# Altium project PCB_Project_2.PrjPcb (part 1 of 3)
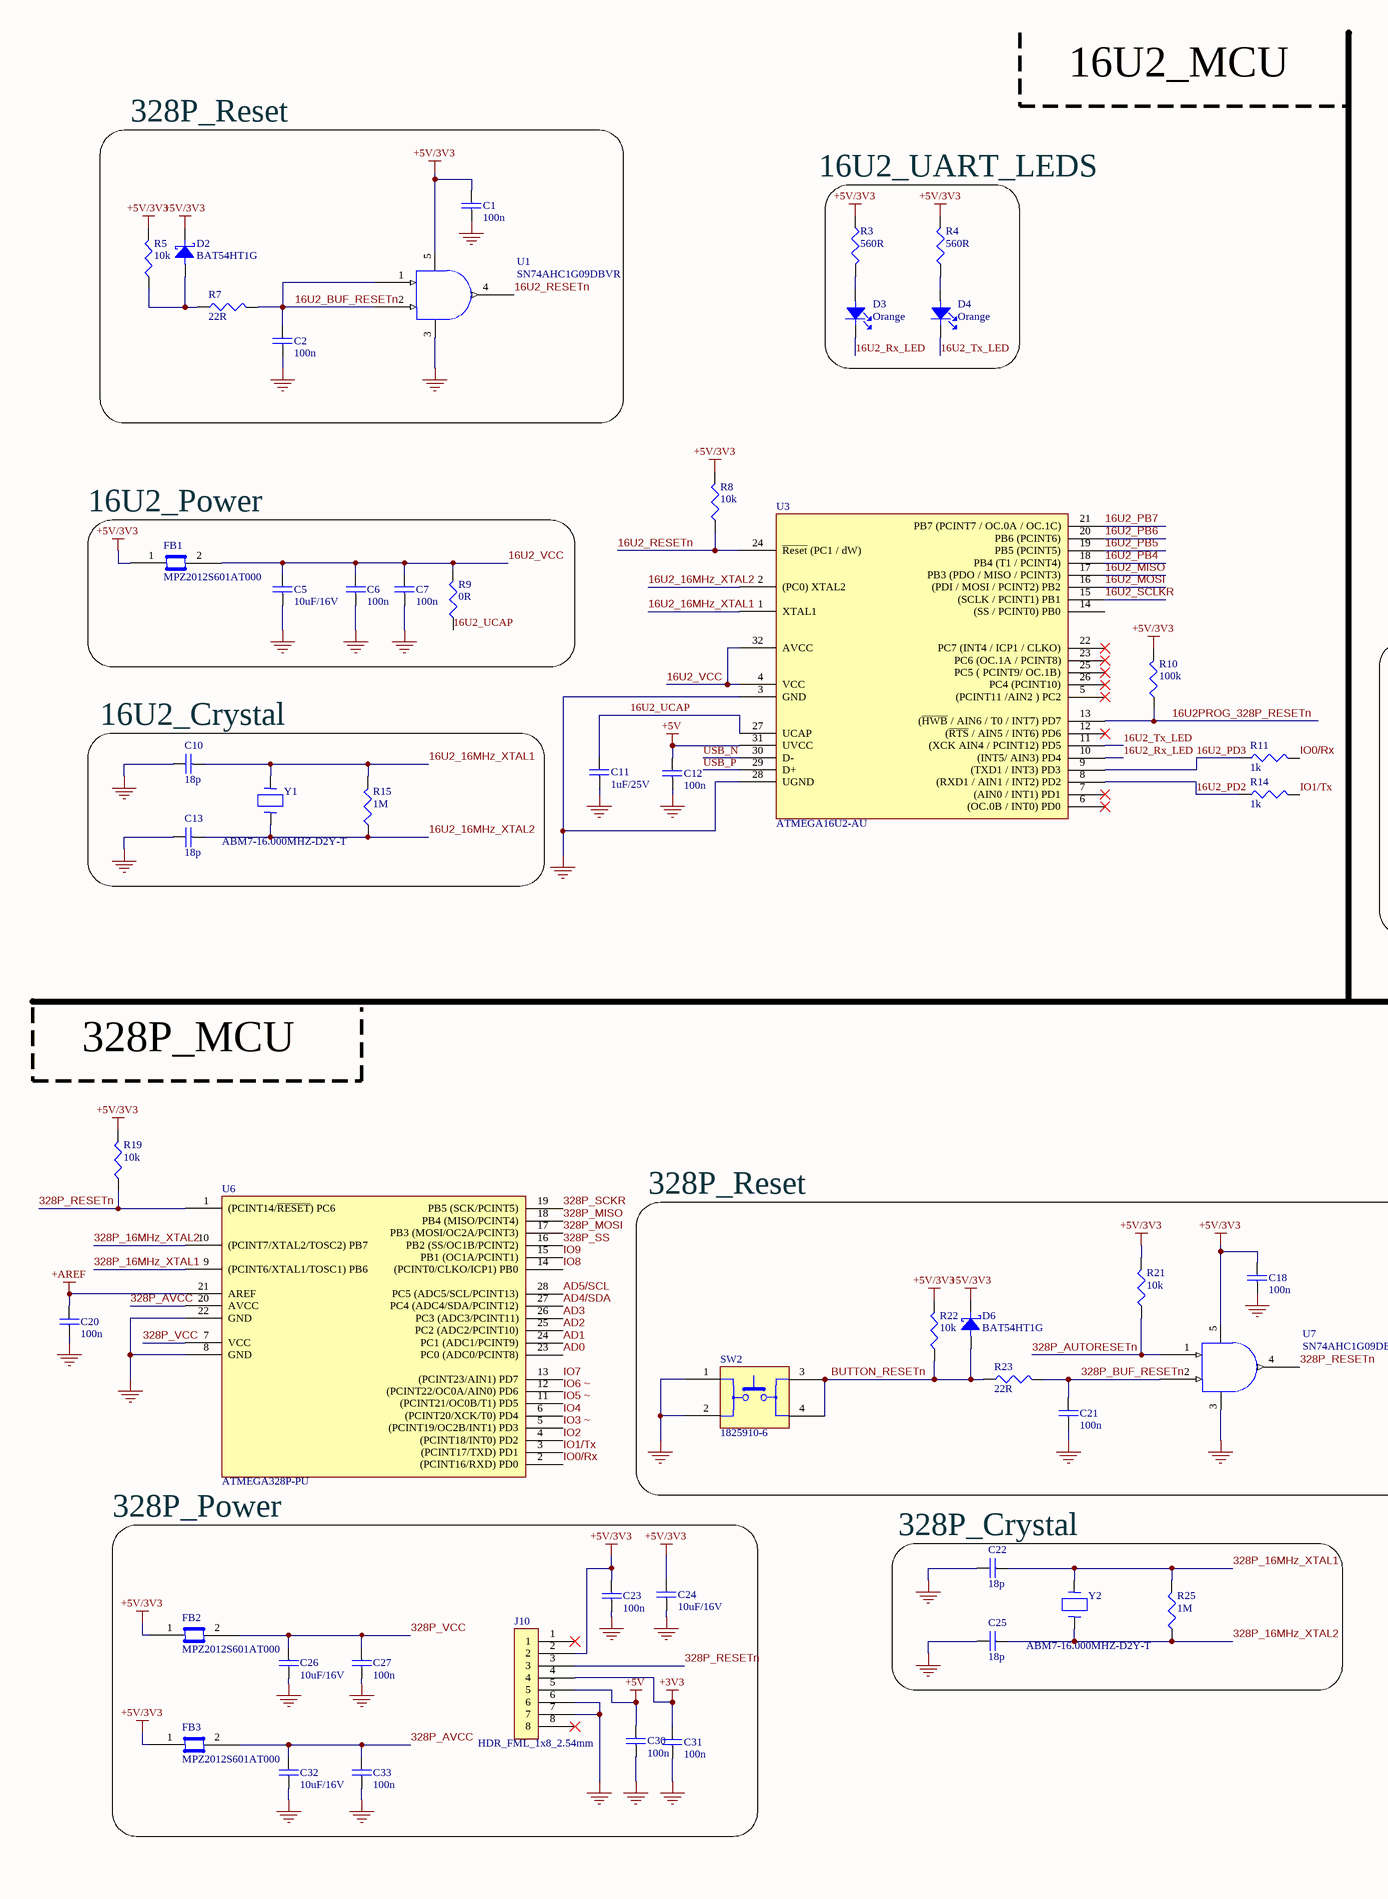
[diagram p0: Sheet1.SchDoc, left]
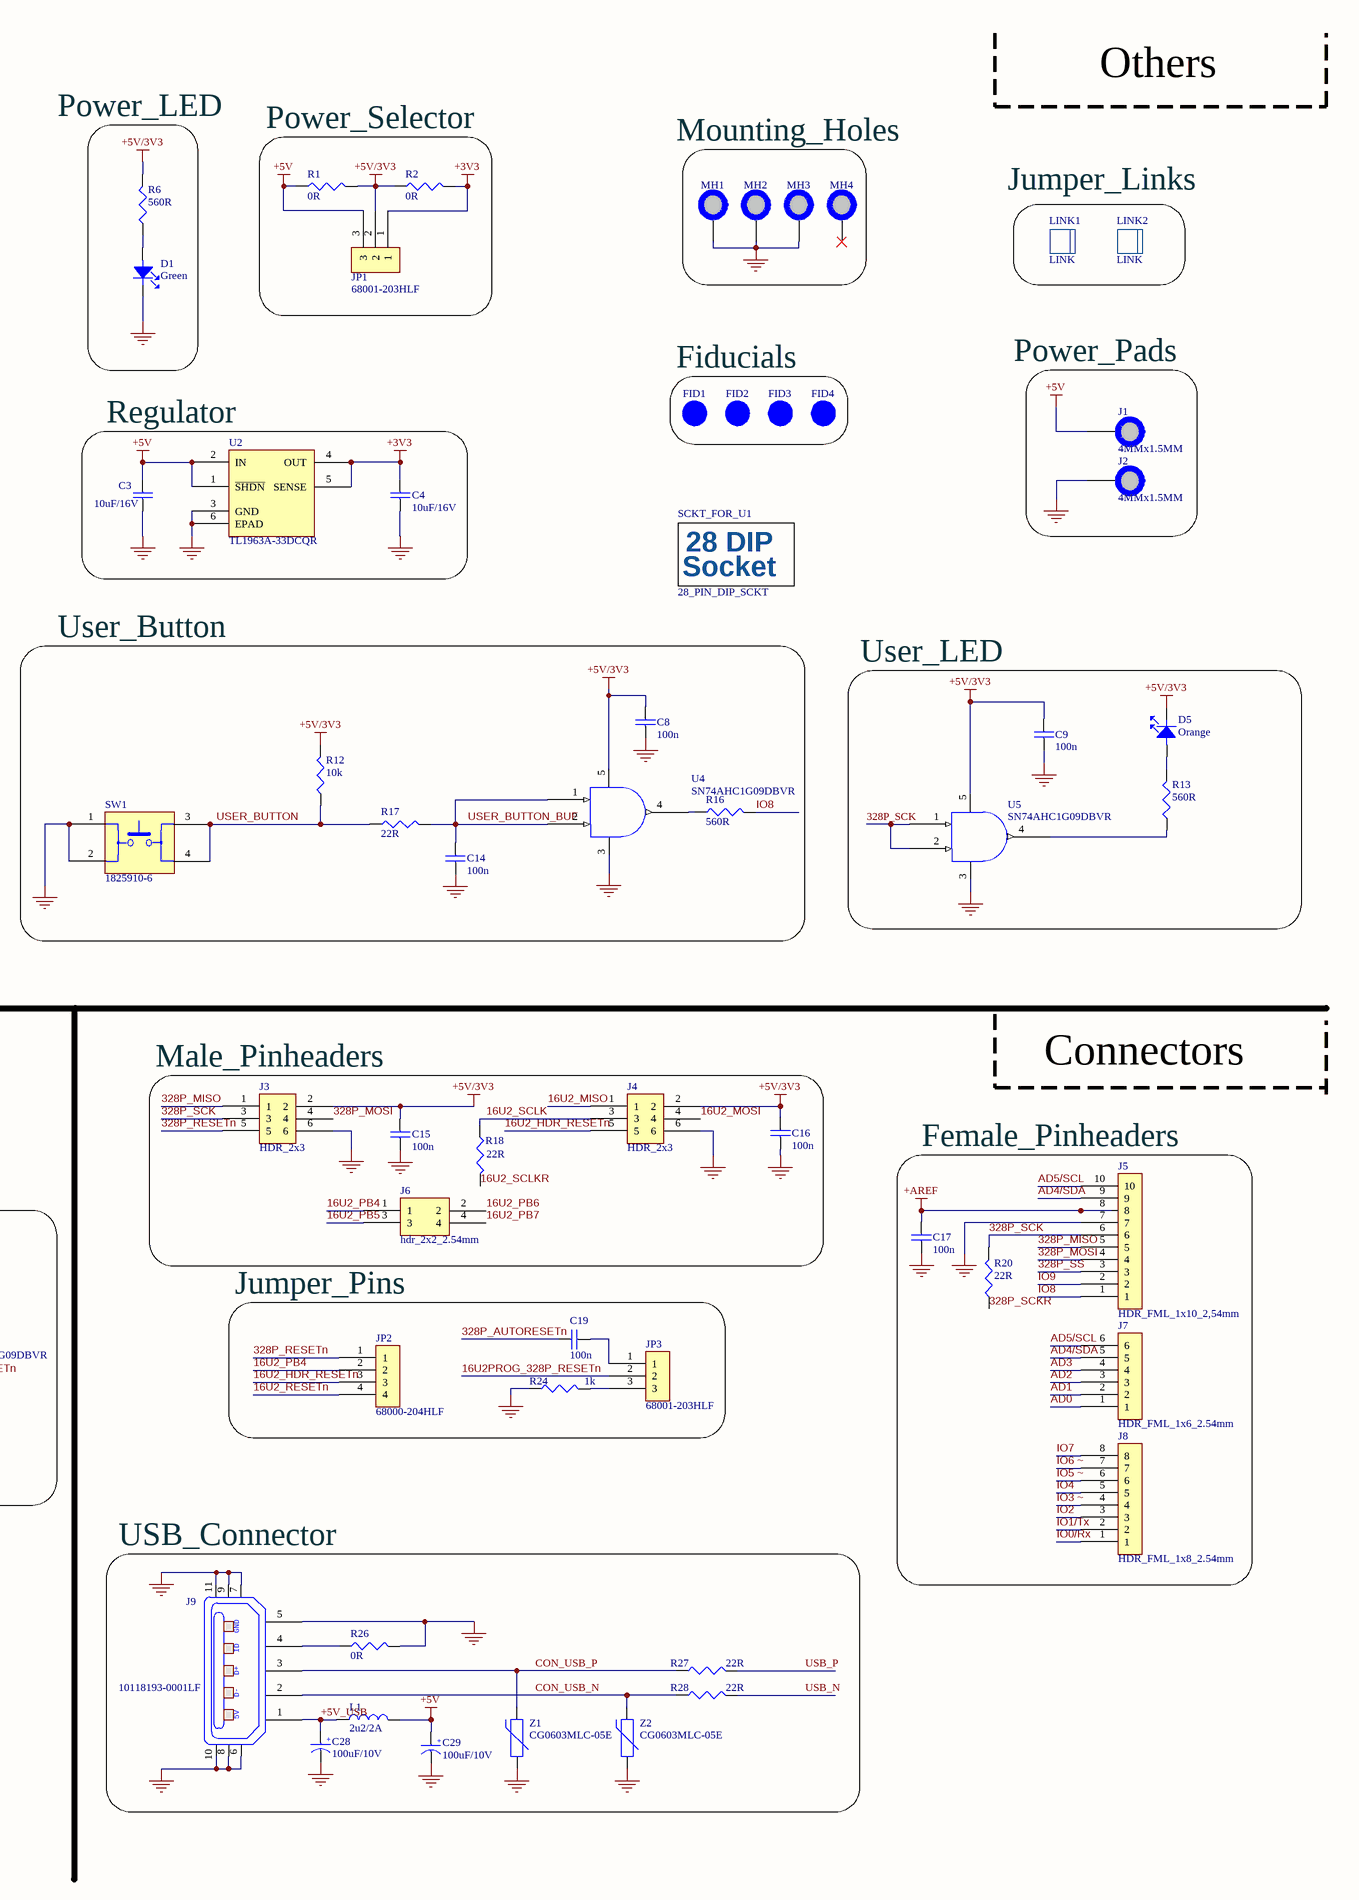
[diagram p1: Sheet1.SchDoc, right]
NotFitted: NF
1 sheet, 108 parts. Net scope: global (net labels, ports and power ports of the same name join across sheets).
Board file: PCB1.PcbDoc

## Sheet Sheet1.SchDoc
size A2; SheetNumber: 1; SheetTotal: 1

### Parts
C1  100n  [C0805_100n]
C2  100n  [C0805_100n]
C3  10uF/16V  [C0805_10u]
C4  10uF/16V  [C0805_10u]
C5  10uF/16V  [C0805_10u]
C6  100n  [C0805_100n]
C7  100n  [C0805_100n]
C8  100n  [C0805_100n]
C9  100n  [C0805_100n]
C10  18p  [C0805_100n]
C11  1uF/25V  [C0805_10u]
C12  100n  [C0805_100n]
C13  18p  [C0805_100n]
C14  100n  [C0805_100n]
C15  100n  [C0805_100n]
C16  100n  [C0805_100n]
C17  100n  [C0805_100n]
C18  100n  [C0805_100n]
C19  100n  [C0805_100n]
C20  100n  [C0805_100n]
C21  100n  [C0805_100n]
C22  18p  [C0805_100n]
C23  100n  [C0805_100n]
C24  10uF/16V  [C0805_10u]
C25  18p  [C0805_100n]
C26  10uF/16V  [C0805_10u]
C27  100n  [C0805_100n]
C28  100uF/10V  [C_ALU_C_SIZE]
C29  100uF/10V  [C_ALU_C_SIZE]
C30  100n  [C0805_100n]
C31  100n  [C0805_100n]
C32  10uF/16V  [C0805_10u]
C33  100n  [C0805_100n]
D1  Green  [LED_0603]
D2  BAT54HT1G  [SOD323]
D3  Orange  [LED_0603]
D4  Orange  [LED_0603]
D5  Orange  [LED_0603]
D6  BAT54HT1G  [SOD323]
FB1  MPZ2012S601AT000  [C0805_100n]
FB2  MPZ2012S601AT000  [C0805_100n]
FB3  MPZ2012S601AT000  [C0805_100n]
FID1  FID_1MM  [FID_40x120]  (value not drawn)  (no BOM)
FID2  FID_1MM  [FID_40x120]  (value not drawn)  (no BOM)
FID3  FID_1MM  [FID_40x120]  (value not drawn)  (no BOM)
FID4  FID_1MM  [FID_40x120]  (value not drawn)  (no BOM)
J1  4MMx1.5MM  [PAD_WITH_HOLE_4MMx1.5MM]  (no BOM)
J2  4MMx1.5MM  [PAD_WITH_HOLE_4MMx1.5MM]  (no BOM)
J3  HDR_2x3  [hdr_2x3_2.54mm]
J4  HDR_2x3  [hdr_2x3_2.54mm]
J5  HDR_FML_1x10_2,54mm  [hdr_fmale_1x10_2.54mm - duplicate]
J6  hdr_2x2_2.54mm  [hdr_2x2_2.54mm]
J7  HDR_FML_1x6_2.54mm  [hdr_fmale_1x6_2.54mm]
J8  HDR_FML_1x8_2.54mm  [hdr_fmale_1x8_2.54mm]
J9  10118193-0001LF  [10118193]
J10  HDR_FML_1x8_2.54mm  [hdr_fmale_1x8_2.54mm]
JP1  68001-203HLF  [hdr_1x3_2.54mm]
JP2  68000-204HLF  [hdr_1x4_2.54mm]
JP3  68001-203HLF  [hdr_1x3_2.54mm]
L1  2u2/2A  [C1210_IND]
LINK1  LINK  (mechanical)
LINK2  LINK  (mechanical)
MH1  MH_7.4MMC_3.2MMD  [MH_7.4MMC_3.2MMD]  (value not drawn)  (no BOM)
MH2  MH_7.4MMC_3.2MMD  [MH_7.4MMC_3.2MMD]  (value not drawn)  (no BOM)
MH3  MH_7.4MMC_3.2MMD  [MH_7.4MMC_3.2MMD]  (value not drawn)  (no BOM)
MH4  MH_7.4MMNC_3.2MMD  [MH_7.4MMNC_3.2MMD]  (value not drawn)  (no BOM)
R1  0R  [R0805]
R2  0R  [R0805]
R3  560R  [R0805]
R4  560R  [R0805]
R5  10k  [R0805]
R6  560R  [R0805]
R7  22R  [R0805]
R8  10k  [R0805]
R9  0R  [R0805]
R10  100k  [R0805]
R11  1k  [R0805]
R12  10k  [R0805]
R13  560R  [R0805]
R14  1k  [R0805]
R15  1M  [R0805]
R16  560R  [R0805]
R17  22R  [R0805]
R18  22R  [R0805]
R19  10k  [R0805]
R20  22R  [R0805]
R21  10k  [R0805]
R22  10k  [R0805]
R23  22R  [R0805]
R24  1k  [R0805]
R25  1M  [R0805]
R26  0R  [R0805]
R27  22R  [R0805]
R28  22R  [R0805]
SCKT_FOR_U1  28_PIN_DIP_SCKT  [28_DIP_7.26mm_SCKT]
SW1  1825910-6  [1825910-6]
SW2  1825910-6  [1825910-6]
U1  SN74AHC1G09DBVR  [DBV_SOT_23_5]
U2  TL1963A-33DCQR  [DCQ (R-PDSO-G6)]
U3  ATMEGA16U2-AU  [TQFP32]
U4  SN74AHC1G09DBVR  [DBV_SOT_23_5]
U5  SN74AHC1G09DBVR  [DBV_SOT_23_5]
U6  ATMEGA328P-PU  [DIP28]
U7  SN74AHC1G09DBVR  [DBV_SOT_23_5]
Y1  ABM7-16.000MHZ-D2Y-T  [ABM7_v1_1_BIG]
Y2  ABM7-16.000MHZ-D2Y-T  [ABM7_v1_1_BIG]
Z1  CG0603MLC-05E  [R0603]
Z2  CG0603MLC-05E  [R0603]

### Blocks framed on the sheet
328P_Reset: C1 C2 D2 R5 R7 U1
Power_Selector: JP1 R1 R2
Fiducials: FID1-FID4
Regulator: C3 C4 U2
16U2_Power: C5-C7 FB1 R9
User_Button: C8 C14 R12 R16 R17 SW1 U4
User_LED: C9 D5 R13 U5
16U2_Crystal: C10 C13 R15 Y1
Male_Pinheaders: C15 C16 J3 J4 J6 R18
Female_Pinheaders: C17 J5 J7 J8 R20
328P_Reset: C18 C21 D6 R21-R23 SW2 U7
Jumper_Pins: C19 JP2 JP3 R24
328P_Power: C23 C24 C26 C27 C30-C33 FB2 FB3 J10
328P_Crystal: C22 C25 R25 Y2
USB_Connector: C28 C29 J9 L1 R26-R28 Z1 Z2

### Nets
+3V3: C4.2 C31.2 J10.4 JP1.1 R2.2 U2.4(OUT) U2.5(SENSE)
+5V: C3.2 C12.2 C29.1 C30.2 J1.1 J10.5 JP1.3 L1.2 R1.1 U2.1(~{SHDN}) U2.2(IN) U3.31(UVCC)
+5V/3V3: C1.2 C8.2 C9.2 C15.2 C16.2 C18.2 C23.2 C24.2 D2.1(Cathode) D5.1(Cathode) D6.1(Cathode) FB1.1 FB2.1 FB3.1 J3.2 J4.2 J10.2 JP1.2 R1.2 R2.1 R3.1 R4.2 R5.2 R6.2 R8.2 R10.2 R12.2 R19.2 R21.2 R22.2 U1.5 U4.5 U5.5 U7.5
+AREF: C17.2 C20.2 J5.8 U6.21(AREF)
GND: C1.1 C2.1 C3.1 C4.1 C5.1 C6.1 C7.1 C8.1 C9.1 C10.1 C11.1 C12.1 C13.1 C14.1 C15.1 C16.1 C17.1 C18.1 C20.1 C21.1 C22.1 C23.1 C24.1 C25.1 C26.1 C27.1 C28.2 C29.2 C30.1 C31.1 C32.1 C33.1 D1.1(Cathode) J2.1 J3.6 J4.6 J5.7 J9.5 J9.6 J9.7 J9.8 J9.9 J9.10 J9.11 J10.6 J10.7 MH1.1 MH2.1 MH3.1 R24.1 R26.2 SW1.1 SW1.2 SW2.1 SW2.2 U1.3 U2.3(GND) U2.6(EPAD) U3.3(GND) U3.28(UGND) U4.3 U5.3 U6.8(GND) U6.22(GND) U7.3 Z1.1 Z2.1
16U2_16MHz_XTAL1: C10.2 R15.2 U3.1(XTAL1) Y1.2
16U2_16MHz_XTAL2: C13.2 R15.1 U3.2((PC0)_XTAL2) Y1.1
16U2_BUF_RESETn: C2.2 R7.2 U1.1 U1.2
16U2_HDR_RESETn: J4.5 JP2.3
16U2_MISO: J4.1 U3.17(PB3_(PDO_/_MISO_/_PCINT3))
16U2_MOSI: J4.4 U3.16((PDI_/_MOSI_/_PCINT2)_PB2)
16U2_PB4: J6.1 JP2.2 U3.18(PB4_(T1_/_PCINT4))
16U2_PB5: J6.3 U3.19(PB5_(PCINT5))
16U2_PB6: J6.2 U3.20(PB6_(PCINT6))
16U2_PB7: J6.4 U3.21(PB7_(PCINT7_/_OC.0A_/_OC.1C))
16U2_PD2: R14.1 U3.8((RXD1_/_AIN1_/_INT2)_PD2)
16U2_PD3: R11.1 U3.9((TXD1_/_INT3)_PD3)
16U2_RESETn: JP2.4 R8.1 U1.4 U3.24(~{Reset}_(PC1_/_dW))
16U2_Rx_LED: D3.1(Cathode) U3.10((INT5/_AIN3)_PD4)
16U2_SCLK: J4.3 R18.1
16U2_SCLKR: R18.2 U3.15((SCLK_/_PCINT1)_PB1)
16U2_Tx_LED: D4.1(Cathode) U3.11((XCK_AIN4_/_PCINT12)_PD5)
16U2_UCAP: C11.2 R9.1 U3.27(UCAP)
16U2_VCC: C5.2 C6.2 C7.2 FB1.2 R9.2 U3.4(VCC) U3.32(AVCC)
16U2PROG_328P_RESETn: JP3.2 R10.1 U3.13((~{HWB}_/_AIN6_/_T0_/_INT7)_PD7)
328P_16MHz_XTAL1: C22.2 R25.2 U6.9((PCINT6/XTAL1/TOSC1)_PB6) Y2.2
328P_16MHz_XTAL2: C25.2 R25.1 U6.10((PCINT7/XTAL2/TOSC2)_PB7) Y2.1
328P_AUTORESETn: C19.1 R21.1 U7.1
328P_AVCC: C32.2 C33.2 FB3.2 U6.20(AVCC)
328P_BUF_RESETn: C21.2 R23.2 U7.2
328P_MISO: J3.1 J5.5 U6.18(PB4_(MISO/PCINT4))
328P_MOSI: J3.4 J5.4 U6.17(PB3_(MOSI/OC2A/PCINT3))
328P_RESETn: J3.5 J10.3 JP2.1 R19.1 U6.1((PCINT14/~{RESET})_PC6) U7.4
328P_SCK: J3.3 J5.6 R20.2 U5.1 U5.2
328P_SCKR: R20.1 U6.19(PB5_(SCK/PCINT5))
328P_SS: J5.3 U6.16(PB2_(SS/OC1B/PCINT2))
328P_VCC: C26.2 C27.2 FB2.2 U6.7(VCC)
+5V_USB: C28.1 J9.1 L1.1
AD0: J7.1 U6.23(PC0_(ADC0/PCINT8))
AD1: J7.2 U6.24(PC1_(ADC1/PCINT9))
AD2: J7.3 U6.25(PC2_(ADC2/PCINT10))
AD3: J7.4 U6.26(PC3_(ADC3/PCINT11))
AD4/SDA: J5.9 J7.5 U6.27(PC4_(ADC4/SDA/PCINT12))
AD5/SCL: J5.10 J7.6 U6.28(PC5_(ADC5/SCL/PCINT13))
BUTTON_RESETn: D6.2(Anode) R22.1 R23.1 SW2.3 SW2.4
CON_USB_N: J9.2 R28.1 Z2.2
CON_USB_P: J9.3 R27.1 Z1.2
IO0/Rx: J8.1 R11.2 U6.2((PCINT16/RXD)_PD0)
IO1/Tx: J8.2 R14.2 U6.3((PCINT17/TXD)_PD1)
IO2: J8.3 U6.4((PCINT18/INT0)_PD2)
IO3 ~: J8.4 U6.5((PCINT19/OC2B/INT1)_PD3)
IO4: J8.5 U6.6((PCINT20/XCK/T0)_PD4)
IO5 ~: J8.6 U6.11((PCINT21/OC0B/T1)_PD5)
IO6 ~: J8.7 U6.12((PCINT22/OC0A/AIN0)_PD6)
IO7: J8.8 U6.13((PCINT23/AIN1)_PD7)
IO8: J5.1 R16.2 U6.14((PCINT0/CLKO/ICP1)_PB0)
IO9: J5.2 U6.15(PB1_(OC1A/PCINT1))
USB_N: R28.2 U3.30(D-)
USB_P: R27.2 U3.29(D+)
USER_BUTTON: R12.1 R17.1 SW1.3 SW1.4
USER_BUTTON_BUF: C14.2 R17.2 U4.1 U4.2
NetC19_2: C19.2 JP3.1
NetD1_2: D1.2(Anode) R6.1
NetD2_2: D2.2(Anode) R5.1 R7.1
NetD3_2: D3.2(Anode) R3.2
NetD4_2: D4.2(Anode) R4.1
NetD5_2: D5.2(Anode) R13.2
NetJ9_4: J9.4 R26.1
NetJP3_3: JP3.3 R24.2
NetR13_1: R13.1 U5.4
NetR16_1: R16.1 U4.4

Not connected (* = marked no-connect by the designer): J10 1* 8*; MH4 1*; U3 5((PCINT11_/AIN2_)_PC2)* 6((OC.0B_/_INT0)_PD0)* 7((AIN0_/_INT1)_PD1)* 12((~{RTS}_/_AIN5_/_INT6)_PD6)* 14((SS_/_PCINT0)_PB0) 22(PC7_(INT4_/_ICP1_/_CLKO))* 23(PC6_(OC.1A_/_PCINT8))* 25(PC5_(_PCINT9/_OC.1B))* 26(PC4_(PCINT10))*

### Notes on the sheet
- 16U2_MCU
- Others
- Power_LED
- Mounting_Holes
- 16U2_UART_LEDS
- Jumper_Links
- Power_Pads
- 328P_MCU
- Connectors
- (in symbol 28_dip_socket) 28 DIP; Socket
- (in symbol 10118193-0001LF) GND; ID; D+; D-; 5V
- (in symbol capacitor_100uF/10V) +